# EAGLE design GeneralSerialCommBoard (EAGLE 8.1.0)

## Sheet 1 of 2
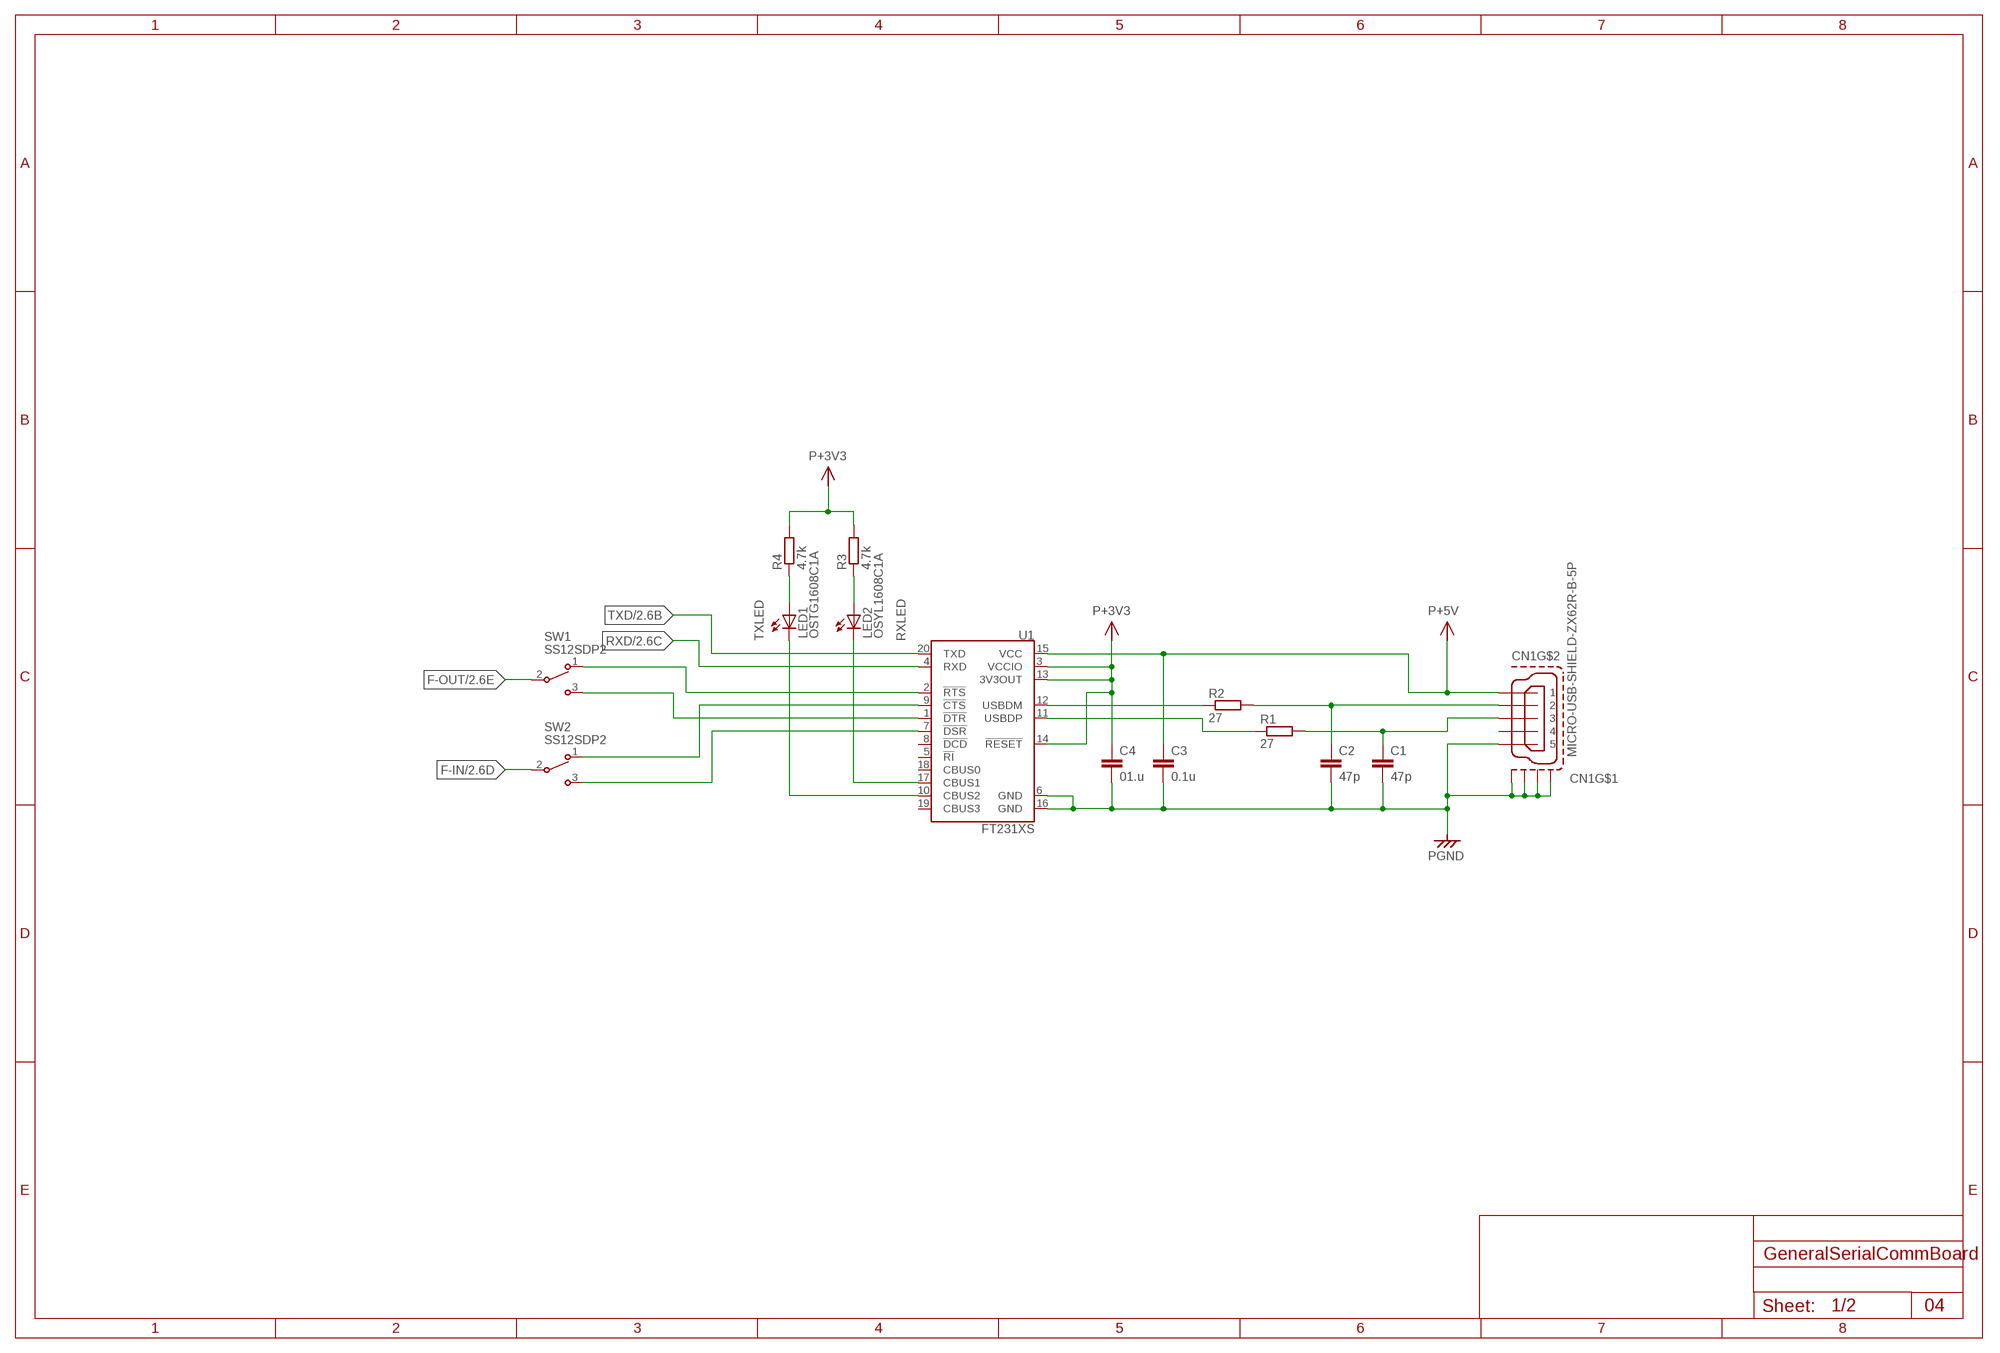
[diagram p0: schematic, sheet 1]

### Parts
C1  47p  C-EUC0603  [C0603]
C2  47p  C-EUC0603  [C0603]
C3  0.1u  C-EUC0603  [C0603]
C4  01.u  C-EUC0603  [C0603]
CN1  MICRO-USB-SHIELD-ZX62R-B-5P  [ZX62R-B-5P]
LED1  OSTG1608C1A  [1608SMD]
LED2  OSYL1608C1A  [1608SMD]
R1  27  R-EU_R0603  [R0603]
R2  27  R-EU_R0603  [R0603]
R3  4.7k  R-EU_R0603  [R0603]
R4  4.7k  R-EU_R0603  [R0603]
SW1  SS12SDP2  [SS12SDP2]
SW2  SS12SDP2  [SS12SDP2]
U1  FT231XS  [SSOP20_L]

### Nets
CBUS1: LED2.K(C) U1.17(CBUS1)
CBUS2: LED1.K(C) U1.10(CBUS2)
CTS: SW2.1(T1) U1.9(!CTS)
DSR: SW2.3(T3) U1.7(!DSR)
DTR: SW1.3(T3) U1.1(!DTR)
F-IN: SW2.2(COM2) ; also sheet 2
F-OUT: SW1.2(COM2) ; also sheet 2
N$2: C1.1 CN1.3 R1.2
N$3: C2.1 CN1.2 R2.2
N$7: LED2.A R3.1
N$8: LED1.A R4.1
N$23: R2.1 U1.12(USBDM)
N$33: R1.1 U1.11(USBDP)
P+3V3: C4.1 R3.2 R4.2 U1.3(VCCIO) U1.13(3V3OUT) U1.14(!RESET) ; also sheet 2
P+5V: C3.1 CN1.1 U1.15(VCC)
PGND: C1.2 C2.2 C3.2 C4.2 CN1.5 CN1.M1(S1) CN1.M2(S2) CN1.M3(S3) CN1.M4(S4) U1.6(GND) U1.16(GND) ; also sheet 2
RTS: SW1.1(T1) U1.2(!RTS)
RXD: U1.4(RXD) ; also sheet 2
TXD: U1.20(TXD) ; also sheet 2
Unconnected: CN1.4 U1.5(!RI) U1.8(!DCD) U1.18(CBUS0) U1.19(CBUS3)

### Notes on the sheet
- TXLED | RXLED
- 04

## Sheet 2 of 2
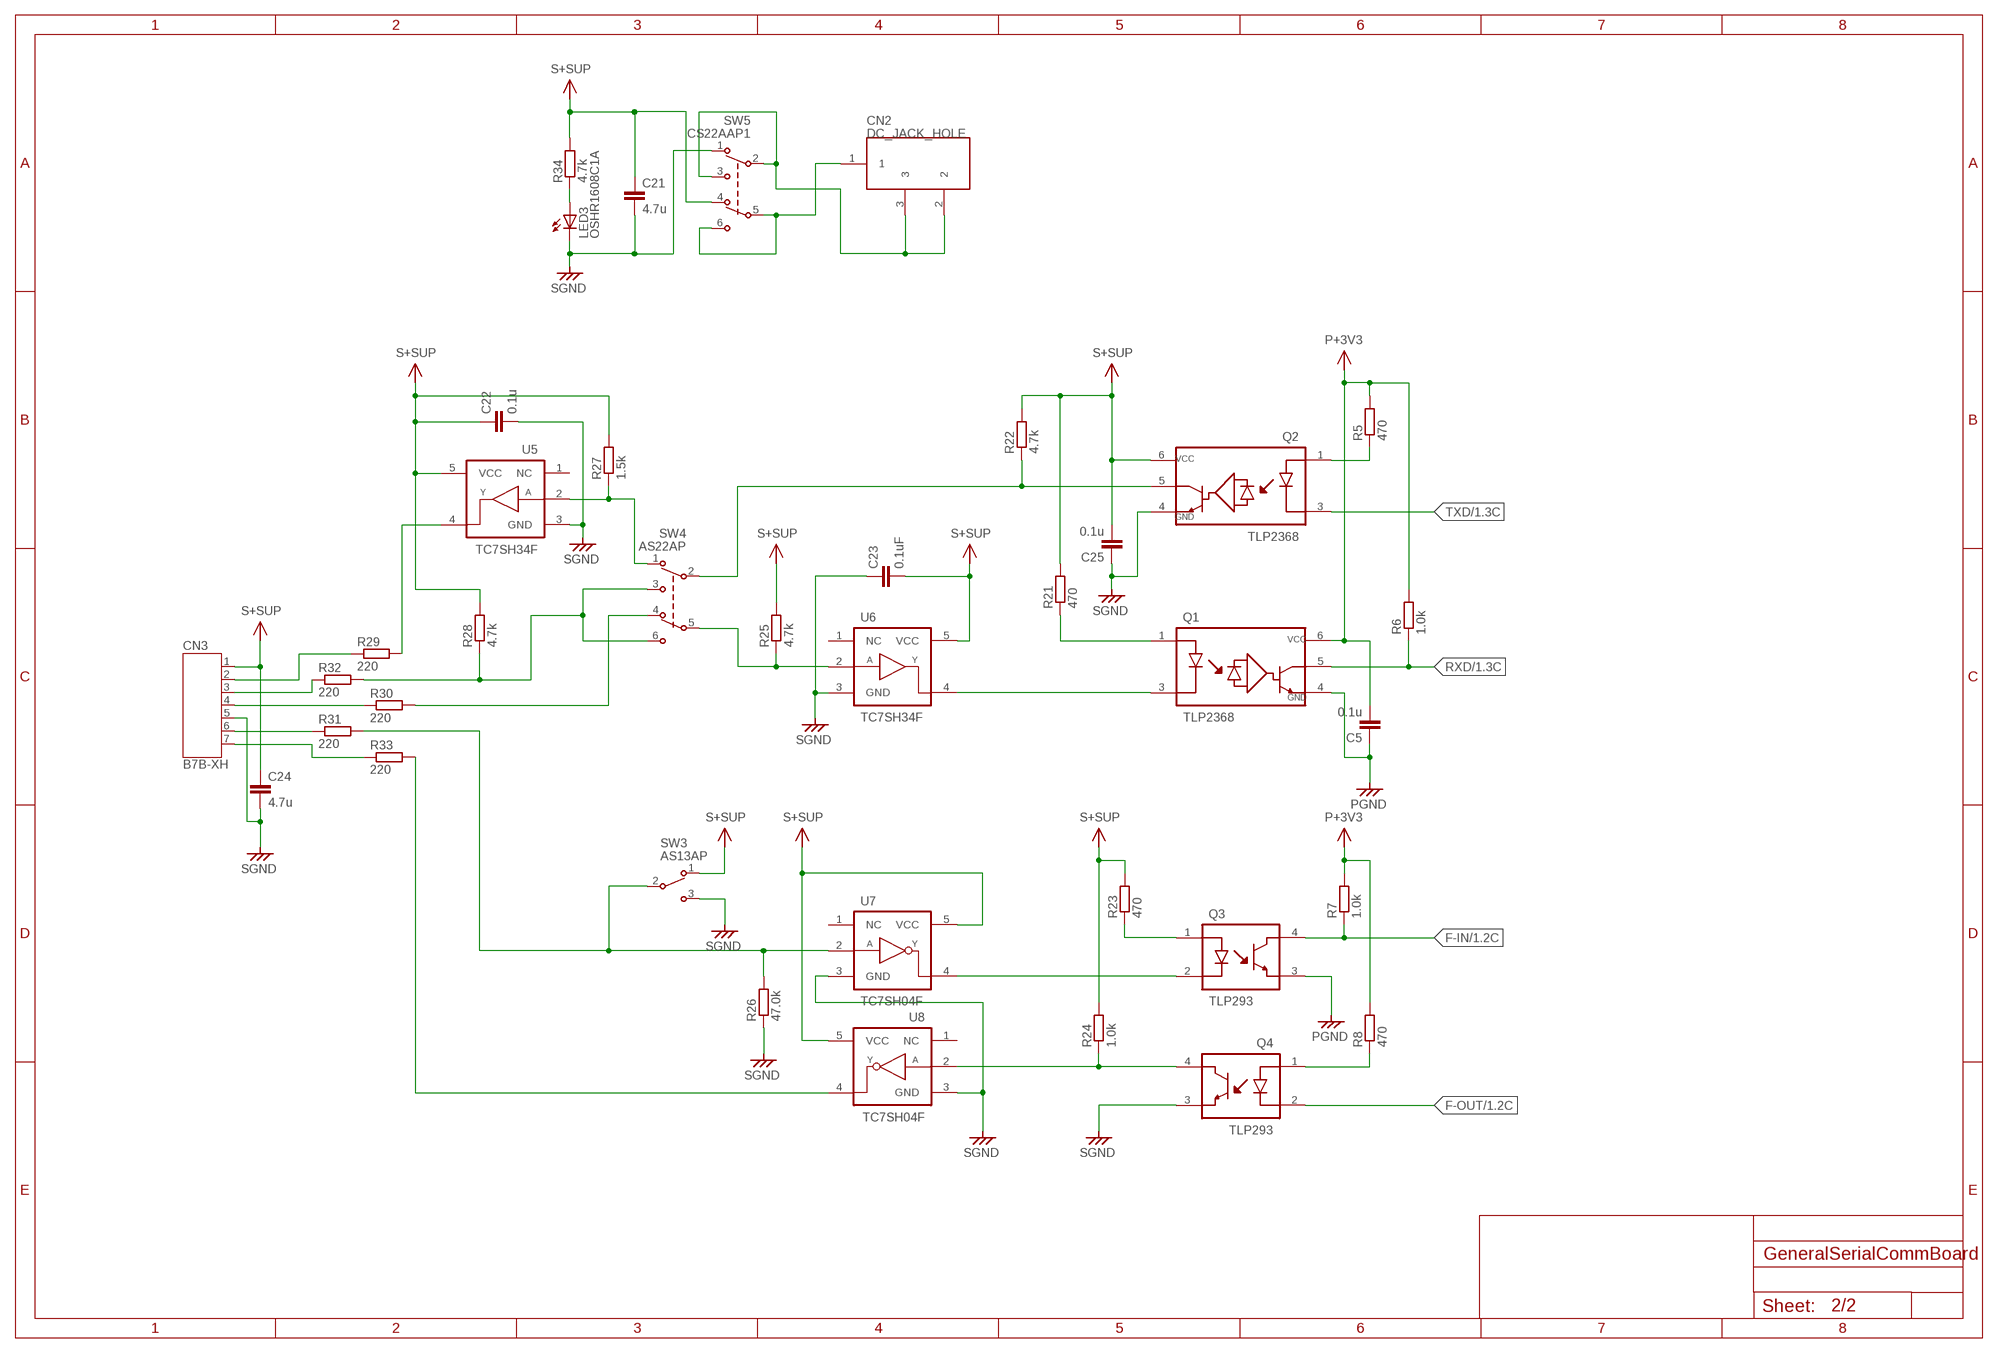
[diagram p1: schematic, sheet 2]

### Parts
C5  0.1u  C-EUC0603  [C0603]
C21  4.7u  C-EUC1206  [C1206]
C22  0.1u  C-EUC0603  [C0603]
C23  0.1uF  C-EUC0603  [C0603]
C24  4.7u  C-EUC1206  [C1206]
C25  0.1u  C-EUC0603  [C0603]
CN2  DC_JACK_HOLE  [DC_JACK_HOLE]
CN3  B7B-XH  [B7B-XH]
LED3  OSHR1608C1A  [1608SMD]
Q1  TLP2368  [SO6-5PIN]
Q2  TLP2368  [SO6-5PIN]
Q3  TLP293  [SO4]
Q4  TLP293  [SO4]
R5  470  R-EU_R0603  [R0603]
R6  1.0k  R-EU_R0603  [R0603]
R7  1.0k  R-EU_R0603  [R0603]
R8  470  R-EU_R0603  [R0603]
R21  470  R-EU_R0603  [R0603]
R22  4.7k  R-EU_R0603  [R0603]
R23  470  R-EU_R0603  [R0603]
R24  1.0k  R-EU_R0603  [R0603]
R25  4.7k  R-EU_R0603  [R0603]
R26  47.0k  R-EU_R0603  [R0603]
R27  1.5k  R-EU_R0603  [R0603]
R28  4.7k  R-EU_R0603  [R0603]
R29  220  R-EU_R0603  [R0603]
R30  220  R-EU_R0603  [R0603]
R31  220  R-EU_R0603  [R0603]
R32  220  R-EU_R0603  [R0603]
R33  220  R-EU_R0603  [R0603]
R34  4.7k  R-EU_R0603  [R0603]
SW3  AS13AP  [AS13AP]
SW4  AS22AP  [AS22AP]
SW5  CS22AAP1  [CS22AAP1]
U5  TC7SH34F  [SMV]
U6  TC7SH34F  [SMV]
U7  TC7SH04F  [SMV]
U8  TC7SH04F  [SMV]

### Nets
F-IN: Q3.4(C) R7.1 ; also sheet 1
F-OUT: Q4.2(K) ; also sheet 1
N$6: CN2.1 SW5.5(COM5) SW5.6(T6)
N$11: CN2.2 CN2.3 SW5.2(COM2) SW5.3(T3)
N$12: Q2.1(A) R5.1
N$13: Q2.5(VO) R22.1 SW4.2(COM2)
N$14: Q4.1(A) R8.1
N$15: CN3.2 R29.1
N$16: CN3.3 R32.1
N$17: CN3.4 R30.1
N$18: CN3.6 R31.1
N$19: CN3.7 R33.1
N$20: R29.2 U5.4(Y)
N$21: R28.1 R32.2 SW4.3(T3) SW4.6(T6)
N$22: R27.1 SW4.1(T1) U5.2(A)
N$24: Q1.1(A) R21.1
N$25: R30.2 SW4.4(T4)
N$26: R25.1 SW4.5(COM5) U6.2(A)
N$27: Q1.3(K) U6.4(Y)
N$28: Q3.1(A) R23.1
N$29: Q3.2(K) U7.4(Y)
N$30: Q4.4(C) R24.1 U8.2(A)
N$31: R26.2 R31.2 SW3.2(COM2) U7.2(A)
N$32: R33.2 U8.4(Y)
N$41: LED3.A R34.1
P+3V3: C5.2 Q1.6(VCC) R5.2 R6.2 R7.2 R8.2 ; also sheet 1
PGND: C5.1 Q1.4(GND) Q3.3(E) ; also sheet 1
RXD: Q1.5(VO) R6.1 ; also sheet 1
S+SUP: C21.1 C22.1 C23.2 C24.1 C25.2 CN3.1 Q2.6(VCC) R21.2 R22.2 R23.2 R24.2 R25.2 R27.2 R28.2 R34.2 SW3.1(T1) SW5.4(T4) U5.5(VCC) U6.5(VCC) U7.5(VCC) U8.5(VCC)
SGND: C21.2 C22.2 C23.1 C24.2 C25.1 CN3.5 LED3.K(C) Q2.4(GND) Q4.3(E) R26.1 SW3.3(T3) SW5.1(T1) U5.3(GND) U6.3(GND) U7.3(GND) U8.3(GND)
TXD: Q2.3(K) ; also sheet 1
Unconnected: U5.1(NC) U6.1(NC) U7.1(NC) U8.1(NC)

## Library data of the parts
C1-C5 C21-C25 = rcl:C-EU: CAPACITOR, European symbol
CN1 = hirose:MICRO-USB-SHIELD-: Hirose Micro USB Connector ZX62R-B-5P: Micro B, reverse (top mount) shell SMT Supplier: DigiKey H11574CT-ND Source: http://www.hirose.co.jp/cataloge_hp/e24200011.pdf
CN2 = misc:DC_JACK_HOLE
CN3 = jst:B7B-XH
LED1 = optosupply:OSTG1608C1A: True green TG λD(nm):525
LED2 = optosupply:OSYL1608C1A: Yellow YL λD(nm):591
LED3 = optosupply:OSHR1608C1A: Red HR λD(nm):625
Q1 Q2 = toshiba:TLP2368
Q3 Q4 = toshiba:TLP293
R1-R8 R21-R34 = rcl:R-EU_: RESISTOR, European symbol
SW1 SW2 = nkk:SS12SDP2
SW3 = nkk:AS13AP
SW4 = nkk:AS22AP
SW5 = nkk:CS22AAP1
U1 = ftdi:FT231X: FTDI FT231X Full Speed USB to Full-handshake UART This USB2.0 Full Speed IC offers a compact bridge to full handshake UART interfaces. The device is a UART, capable of operating up to 3MBaud, with low power consumption (8mA). The FT231X includes the complete FT-X series feature set and enables USB to be added into a system design quickly and easily over a UART interface.
U5 U6 = toshiba:TC7SH34F
U7 U8 = toshiba:TC7SH04F

## Board
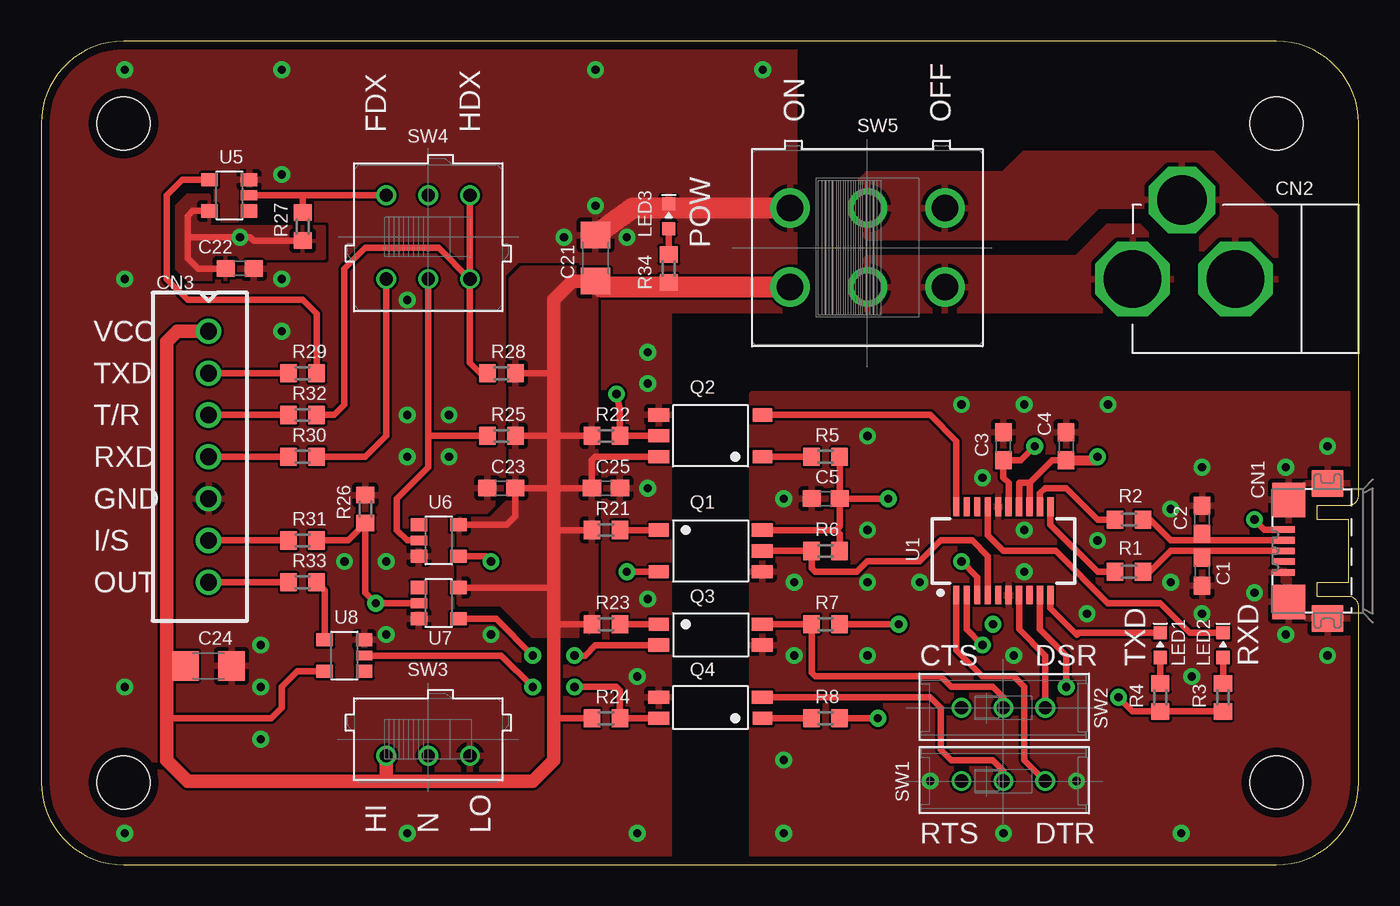
[diagram p2: board, top side]
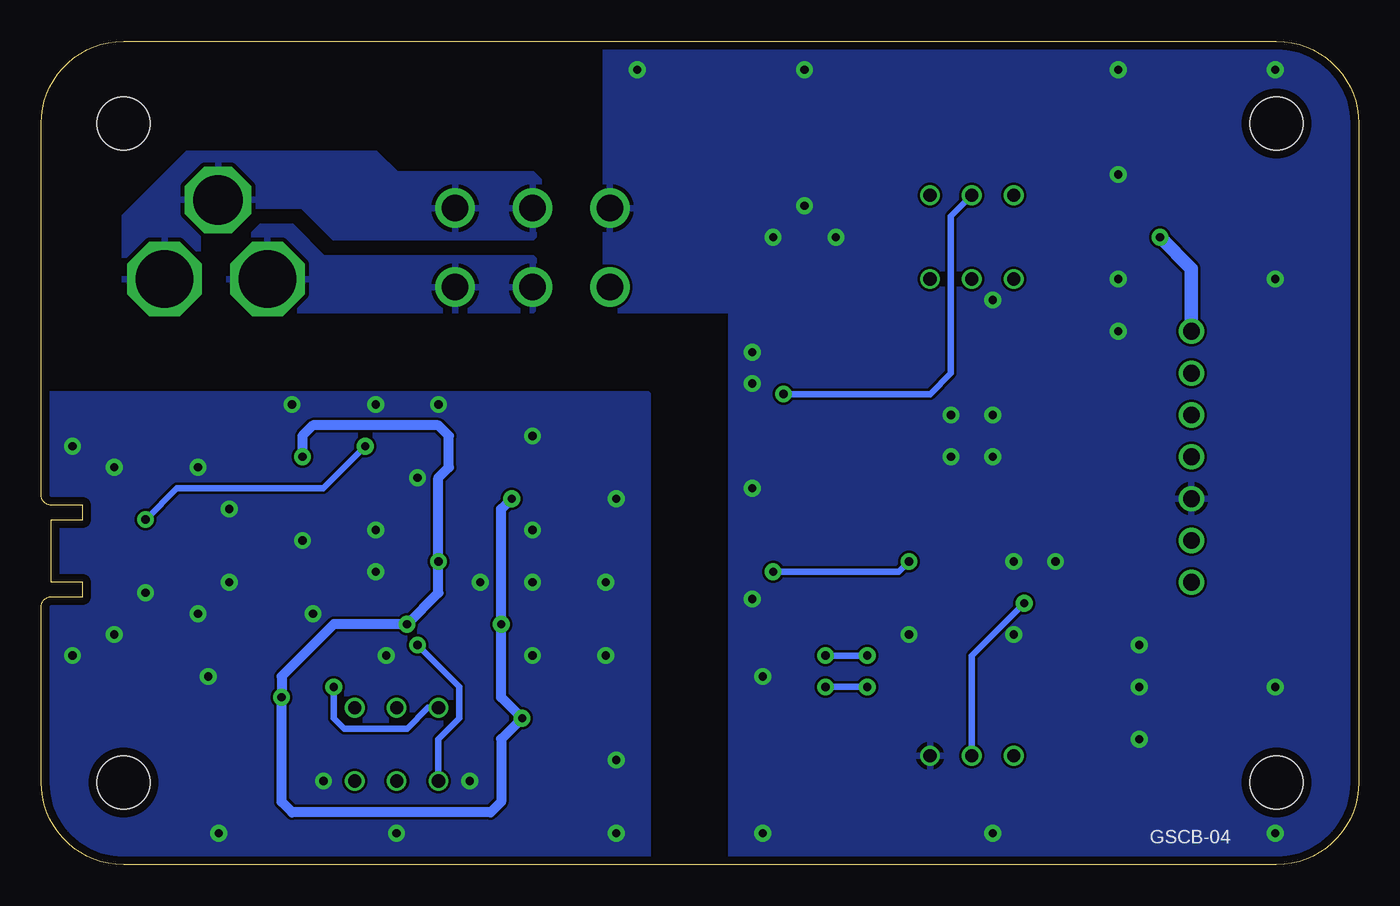
[diagram p3: board, bottom side, seen from below]

Size 80 x 50 mm. Coordinates in mm from the lower left corner, seen from the top.
Outline: 0,5 arc90 5,0 75,0 arc90 80,5 80,15.65 arc90 79.38,16.28 77.47,16.28 77.47,17.14 79.38,17.14 79.38,20.95 77.47,20.95 77.47,21.82 79.38,21.82 arc90 80,22.45 80,45 arc90 75,50 5,50 arc90 0,45 0,5
Copper layers (1*16): Top 0.035mm / dielectric 1.6mm / Bottom 0.035mm
Design rules "Elecrow_2-layer_PCB_eagle_rule": minimum track width 6mil, minimum drill 12mil, track to track 6mil, track to pad 6mil, pad to pad 6mil, via to via 8mil, smd to smd 0mil, copper to edge 20mil, drill to drill 10mil, minimum pad ring 6mil, minimum via ring 6mil, stop-mask expansion 0mil, vias tented up to drill 100mil, thermal gap 10mil
Holes 3.2 mm at 5,45 5,5 75,45 75,5

### Footprints (pad centres in the part's own frame; a part is rotated, then mirrored left to right if it is on the bottom)
C0603 = smd 1.1 x 1: 1 -0.85,0; 2 0.85,0
C1206 = smd 1.6 x 1.8: 1 -1.4,0; 2 1.4,0
ZX62R-B-5P = smd 1.35 x 0.4: 1 2.675,-1.3; 2 2.675,-0.65; 3 2.675,0; 4 2.675,0.65; 5 2.675,1.3 | smd 1.9 x 1.6: M1 0,-4.1; M2 0,4.1 | smd 2 x 2.1: M3 2.35,3.1; M4 2.35,-3.1
DC_JACK_HOLE = drill 3.5 octagon: 1 -13.75,0; 2 -7.5,0 | drill 3 octagon: 3 -10.75,4.8
B7B-XH = drill 1.016: 1 7.62,0; 2 5.08,0; 3 2.54,0; 4 0,0; 5 -2.54,0; 6 -5.08,0; 7 -7.62,0
1608SMD = smd 0.8 x 0.8: A -0.75,0; K 0.75,0
SO6-5PIN = smd 0.8 x 1.2: 1 -1.27,-3.15; 3 1.27,-3.15 | smd 0.8 x 1.27: 4 1.27,3.15; 5 0,3.15; 6 -1.27,3.15
SO4 = smd 0.8 x 1.2: 1 -0.635,-3.15 | smd 0.8 x 1.27: 2 0.635,-3.15; 3 0.635,3.15; 4 -0.635,3.15
R0603 = smd 1 x 1.1: 1 -0.85,0; 2 0.85,0
SS12SDP2 = drill 0.8: 1 0,2.54; 2 0,0; 3 0,-2.54
AS13AP = drill 0.8: 1 -1,2.54; 2 -1,0; 3 -1,-2.54
AS22AP = drill 0.8: 1 2.54,2.54; 2 2.54,0; 3 2.54,-2.54; 4 -2.54,2.54; 5 -2.54,0; 6 -2.54,-2.54
CS22AAP1 = drill 1.6: 1 2.4,4.7; 2 2.4,0; 3 2.4,-4.7; 4 -2.4,4.7; 5 -2.4,0; 6 -2.4,-4.7
SSOP20_L = smd 0.381 x 1.143: 1 -2.857,-2.68; 2 -2.223,-2.68; 3 -1.587,-2.68; 4 -0.953,-2.68; 5 -0.318,-2.68; 6 0.318,-2.68; 7 0.953,-2.68; 8 1.587,-2.68; 9 2.223,-2.68; 10 2.857,-2.68; 11 2.857,2.68; 12 2.223,2.68; 13 1.587,2.68; 14 0.953,2.68; 15 0.318,2.68; 16 -0.318,2.68; 17 -0.953,2.68; 18 -1.587,2.68; 19 -2.223,2.68; 20 -2.857,2.68
SMV = smd 0.8 x 1: 1 -0.95,-1.2; 3 0.95,-1.2; 4 0.95,1.2; 5 -0.95,1.2 | smd 0.6 x 1: 2 0,-1.2

### Placement (x,y rotation side)
C1  70.48,17.78 270 top
C2  70.48,20.95 90 top
C3  58.42,25.4 90 top
C4  62.23,25.4 90 top
C5  47.62,22.23 0 top
C21  33.66,36.83 90 top
C22  12.06,36.2 0 top
C23  27.94,22.86 0 top
C24  10.16,12.06 0 top
C25  34.29,22.86 180 top
CN1  78.11,19.05 180 top
CN2  80.01,35.56 0 top
CN3  10.16,24.77 90 top
LED1  67.94,13.34 90 top
LED2  71.75,13.34 90 top
LED3  38.1,39.37 90 top
Q1  40.64,19.05 270 top
Q2  40.64,26.04 90 top
Q3  40.64,13.97 270 top
Q4  40.64,9.53 90 top
R1  66.04,17.78 0 top
R2  66.04,20.95 0 top
R3  71.75,10.16 270 top
R4  67.94,10.16 270 top
R5  47.62,24.77 0 top
R6  47.62,19.05 0 top
R7  47.62,14.61 0 top
R8  47.62,8.89 0 top
R21  34.29,20.32 180 top
R22  34.29,26.04 180 top
R23  34.29,14.61 180 top
R24  34.29,8.89 180 top
R25  27.94,26.04 0 top
R26  19.68,21.59 270 top
R27  15.88,38.73 270 top
R28  27.94,29.84 0 top
R29  15.88,29.84 0 top
R30  15.88,24.77 0 top
R31  15.88,19.68 0 top
R32  15.88,27.3 0 top
R33  15.88,17.14 0 top
R34  38.1,36.2 270 top
SW1  58.42,5.08 90 top
SW2  58.42,9.53 90 top
SW3  23.5,7.62 90 top
SW4  23.5,38.1 90 top
SW5  50.16,37.47 90 top
U1  58.42,19.05 0 top
U5  11.43,40.64 90 top
U6  24.13,19.68 270 top
U7  24.13,15.88 270 top
U8  18.41,12.7 90 top

### Tracks (layer width: path | path; a pad name or v marks a point on that pad's centre or on a via)
CBUS1
  Top 0.381: LED2.K 69.73,14.09 67.94,15.88 64.77,15.88 61.59,19.05 58.42,19.05 57.47,20 U1.17
CBUS2
  Top 0.381: U1.10 61.28,15.56 62.87,13.97 | LED1.K 62.98,14.09
  Top 0.406: 62.98,14.09 62.87,13.97
CTS  (via drill 0.5 pad 1.02)
  Top 0.381: U1.9 60.64,14.29 62.23,12.7
  Top 0.406: v62.23,10.79 62.23,12.7
  Bottom 0.381: SW2.1 56.52,9.53 57.78,8.26 61.59,8.26 62.23,8.89 v62.23,10.79
DSR
  Top 0.381: U1.7 59.37,14.29 60.96,12.7
  Top 0.406: SW2.3 60.96,12.7
DTR
  Top 0.381: SW1.3 59.69,6.35 59.69,10.79 59.05,11.43 57.15,11.43 55.56,13.02 U1.1
F-IN
  Top 0.381: Q3.4 R7.1 46.77,11.64 46.99,11.43 54.61,11.43 55.24,10.79 57.78,10.79 58.42,10.16 SW2.2
F-OUT
  Top 0.381: Q4.2 53.98,10.16 54.61,9.53 54.61,6.99 55.24,6.35 57.78,6.35 58.42,5.71 SW1.2
N$2
  Top 0.381: 70.48,19.05 68.58,19.05 67.53,18
  Top 0.406: R1.2 67.31,17.78 67.53,18 | CN1.3 70.48,19.05 C1.1
N$3
  Top 0.381: 70.48,19.7 68.58,19.7
  Top 0.406: R2.2 67.33,20.95 68.58,19.7 | CN1.2 70.48,19.7 C2.1
N$6
  pour Bottom: 62.87,36.83 50.16,36.83 49.53,36.2 49.53,34.29 50.16,33.66 67.94,33.66 68.58,34.29 68.58,36.83 66.67,38.73 64.77,38.73
  pour Top: 64.77,38.73 62.87,36.83 50.16,36.83 49.53,36.2 49.53,34.29 50.16,33.66 67.94,33.66 68.58,34.29 68.58,36.83 66.67,38.73
N$7
  Top 0.381: R3.1 LED2.A
N$8
  Top 0.381: R4.1 LED1.A
N$11
  pour Bottom: 62.23,38.1 50.16,38.1 49.53,38.73 49.53,41.27 50.16,41.91 58.42,41.91 59.69,43.18 71.12,43.18 74.93,39.37 74.93,34.29 74.3,33.66 71.12,33.66 70.48,34.29 70.48,38.1 68.58,40.01 64.14,40.01
  pour Top: 50.16,41.91 49.53,41.27 49.53,38.73 50.16,38.1 62.23,38.1 64.14,40.01 68.58,40.01 70.48,38.1 70.48,34.29 71.12,33.66 74.3,33.66 74.93,34.29 74.93,39.37 71.12,43.18 59.69,43.18 58.42,41.91
N$12
  Top 0.381: Q2.1 R5.1
N$13  (via drill 0.5 pad 1.02)
  Top 0.381: Q2.5 R22.1 35.14,27.73 v34.92,28.57
  Bottom 0.381: v34.92,28.57 26.04,28.57 24.77,29.84 24.77,39.37 SW4.2
N$14
  Top 0.381: Q4.1 R8.1
N$15
  Top 0.381: R29.1 CN3.2
N$16
  Top 0.381: R32.1 CN3.3
N$17
  Top 0.381: R30.1 CN3.4
N$18
  Top 0.381: R31.1 CN3.6
N$19
  Top 0.381: R33.1 CN3.7
N$20
  Top 0.381: R29.2 16.73,33.44 15.88,34.29 8.89,34.29 7.62,35.56 7.62,40.64 8.57,41.59 U5.4
N$21
  Top 0.381: SW4.3 SW4.6 | R32.2 17.78,27.3 18.41,27.94 18.41,36.2 19.68,37.47 24.13,37.47 SW4.6 | R28.1 26.67,29.84 26.04,30.48 SW4.6
N$22
  Top 0.381: U5.2 15.88,40.64 | 15.88,40.64 SW4.1 | R27.1 15.88,40.64
N$23
  Top 0.381: U1.12 60.64,22.54 60.96,22.86 62.23,22.86 64.14,20.95 R2.1
N$24
  Top 0.381: R21.1 Q1.1
N$25
  Top 0.381: SW4.4 20.95,26.04 19.68,24.77 R30.2
N$26
  Top 0.381: U6.2 22.23,19.68 21.59,20.32 21.59,22.23 23.5,24.13 23.5,26.04 | SW4.5 23.5,26.04 | R25.1 23.5,26.04
N$27  (via drill 0.5 pad 1.02)
  Top 0.381: v35.56,17.78 Q1.3 | U6.4 26.98,18.73 v27.3,18.41
  Bottom 0.381: v35.56,17.78 27.94,17.78 v27.3,18.41
N$28
  Top 0.381: R23.1 Q3.1
N$29  (via drill 0.5 pad 1.02)
  Top 0.381: v32.38,12.7 33.02,12.7 33.66,13.34 Q3.2 | U7.4 27.62,14.93 v29.84,12.7
  Bottom 0.381: v29.84,12.7 v32.38,12.7
N$30  (via drill 0.5 pad 1.02)
  Top 0.381: Q4.4 R24.1 35.14,10.58 34.92,10.79 v32.38,10.79 | U8.2 27.94,12.7 v29.84,10.79
  Bottom 0.381: v29.84,10.79 v32.38,10.79
N$31  (via drill 0.5 pad 1.02)
  Top 0.381: U7.2 v20.32,15.88 19.68,16.51 R26.2 18.63,19.68 R31.2
  Bottom 0.381: SW3.2 23.5,12.7 v20.32,15.88
N$32
  Top 0.381: U8.4 17.21,16.66 R33.2
N$33
  Top 0.381: U1.11 61.28,20.64 64.14,17.78 R1.1
N$41
  Top 0.381: R34.1 LED3.A
P+3V3  (via drill 0.5 pad 1.02)
  Top 0.381: R3.2 R4.2 66.25,9.31 v65.41,10.16 | C5.2 48.48,20.54 48.26,20.32 | 48.26,20.32 Q1.6 | R6.2 48.48,20.11 48.26,20.32 | C5.2 R5.2 | C5.2 v51.44,22.23 | R8.2 v50.8,8.89 | R7.2 v52.07,14.61 | U1.3 56.83,17.46 v55.88,18.41 | U1.13 60.01,23.18 | 60.01,23.18 61.38,24.55 C4.1 | U1.14 59.37,23.18 60.01,23.18
  Top 0.61: C4.1 63.92,24.55 v64.14,24.77
  Bottom 0.61: v51.44,22.23 52.07,21.59 v52.07,14.61 52.07,10.16 v50.8,8.89 52.07,7.62 52.07,3.81 52.7,3.17 64.77,3.17 65.41,3.81 v65.41,10.16 65.41,11.43 62.23,14.61 v57.78,14.61 55.88,16.51 v55.88,18.41 55.88,23.5 55.24,24.13 55.24,26.04 55.88,26.67 63.5,26.67 64.14,26.04 v64.14,24.77
P+5V  (via drill 0.5 pad 1.02)
  Top 0.381: 74.27,20.35 v73.66,20.95 | U1.15 58.74,23.18 58.42,23.5 C3.1 59.48,24.55
  Top 0.406: v60.33,25.4 59.48,24.55 | CN1.1 74.27,20.35
  Bottom 0.381: v73.66,20.95 71.75,22.86 62.87,22.86
  Bottom 0.406: 62.87,22.86 v60.33,25.4
PGND  (via drill 0.5 pad 1.02)
  other vias: 45.72,17.14 45.72,12.7 68.58,21.59 59.69,17.78 55.88,27.94 68.58,17.14 70.48,24.13 73.66,16.51 45.09,22.23 50.16,26.04 45.09,1.91 78.11,12.7 78.11,25.4 75.56,24.13 75.56,13.97 59.69,20.32 62.87,5.08 53.98,5.08 50.16,12.7 69.22,1.91 58.42,1.91 69.85,11.43 50.16,17.14 70.48,15.24 59.69,27.94 64.77,27.94 53.34,17.14 57.15,23.5 63.5,15.24 64.14,19.68 59.05,12.7 50.16,20.32 45.09,6.35
  pour Top (rank 3): 43.18,28.57 81.28,28.57 81.28,-0.64 43.18,-0.64
  pour Bottom (rank 3): 43.18,28.57 82.55,28.57 82.55,-1.91 43.18,-1.91
RTS  (via drill 0.5 pad 1.02)
  Top 0.381: U1.2 56.2,14.29 v57.15,13.34
  Bottom 0.381: v57.15,13.34 54.61,10.79 54.61,8.89 55.88,7.62 55.88,5.71
  Bottom 0.406: 55.88,5.71 SW1.1
RXD
  Top 0.381: Q1.5 R6.1
  Top 0.406: U1.4 57.47,18.73 56.52,19.68 54.61,19.68 53.34,18.41 50.16,18.41 49.53,17.78 46.99,17.78 46.77,18 R6.1
S+SUP  (via drill 0.5 pad 1.02)
  Top 0.381: U5.5 9.21,39.69 8.89,39.37 8.89,38.1 | C22.1 9.53,36.2 8.89,36.83 8.89,38.1 | R27.2 12.91,37.88 12.7,38.1 v12.06,38.1 8.89,38.1 | U6.5 28.25,20.64 28.79,21.17 C23.2 31.11,22.86 C25.2 33.44,24.55 33.66,24.77 Q2.6 | R28.2 31.11,29.84 | R25.2 31.11,26.04 R22.2 | R21.2 31.11,20.32 | R23.2 31.11,14.61 | R24.2 31.11,8.89 | U8.5 15.56,11.75 14.61,10.79 14.61,9.53 13.97,8.89 7.62,8.89 | C24.1 7.62,12.06 | U7.5 30.8,16.82 31.11,16.51 | R34.2 38.1,35.06
  Top 0.813: CN3.1 8.26,32.38 7.62,31.75 7.62,12.06 7.62,8.89 7.62,6.35 8.89,5.08 20.95,5.08 | 20.95,5.08 29.84,5.08 31.11,6.35 31.11,8.89 31.11,14.61 31.11,16.51 31.11,20.32 31.11,22.86 31.11,26.04 31.11,29.84 31.11,34.29 32.26,35.43 C21.1 | SW3.1 20.95,5.08
  Top 1.27: SW5.4 38.1,35.06 34.02,35.06 C21.1
  Bottom 0.813: CN3.1 10.16,36.2 v12.06,38.1
  pour Top: 10.16,40.64 10.16,38.73 17.14,38.73 17.14,36.83 11.43,36.83 11.43,35.56 8.89,35.56 8.26,36.2 8.26,40.01 8.89,40.64
  pour Top: 27.94,15.88 29.84,13.97 33.02,13.97 33.66,14.61 33.66,35.56 33.02,36.2 29.21,36.2 28.57,35.56 28.57,22.23 27.3,20.95 25.4,20.95 25.4,15.88
SGND  (via drill 0.5 pad 1.02)
  Top 0.381: LED3.K 38.1,39.87
  Top 1.27: SW5.1 38.1,39.87 35.92,39.87 C21.2
  other vias: 36.83,22.86 36.83,31.11 36.2,11.43 20.95,18.41 20.95,13.97 14.61,41.91 31.75,38.1 33.66,40.01 35.56,38.1 13.34,10.79 13.34,13.34 14.61,35.56 13.34,7.62 24.77,24.77 5.08,48.26 5.08,1.91 36.2,1.91 22.23,34.29 24.77,27.3 43.81,48.26 36.83,16.13 36.83,29.21 18.41,18.41 22.23,27.3 22.23,24.77 14.61,48.26 33.66,48.26 5.08,35.56 5.08,10.79 22.23,1.91 27.3,13.97 14.61,32.38
  pour Bottom (rank 3): 38.1,33.66 38.1,-1.91 -3.17,-1.91 -3.17,52.7 45.72,52.7 45.72,33.66
  pour Top (rank 3): 38.1,33.66 38.1,-0.64 -1.91,-0.64 -1.91,51.44 45.72,51.44 45.72,33.66
TXD
  Top 0.381: U1.20 55.56,25.72 53.98,27.3 Q2.3

### Text on the board
tPlace: ON | OFF | FDX | HDX | POW | CTS | DSR | TXD | RXD | HI | N | LO | RTS | DTR
bPlace: GSCB-04
tNames: VCC | TXD | T/R | RXD | GND | I/S | OUT